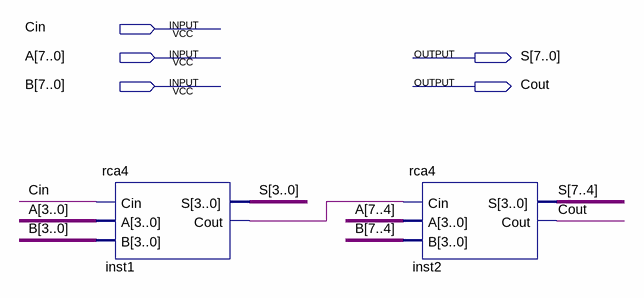
[diagram p0: schematic sheet]
// Quartus schematic rca8.bdf as structural Verilog: 2 symbols, 5 pins
module rca8 (
  input  Cin,
  input  [7:0] A,
  input  [7:0] B,
  output [7:0] S,
  output Cout
);

  wire inst1_cout;

  rca4 inst1 (.Cin(Cin), .A(A[3:0]), .B(B[3:0]), .S(S[3:0]), .Cout(inst1_cout));
  rca4 inst2 (.Cin(inst1_cout), .A(A[7:4]), .B(B[7:4]), .S(S[7:4]), .Cout(Cout));
endmodule
